# EAGLE schematic esquema_eletrico_eagle (EAGLE 9.7.0)
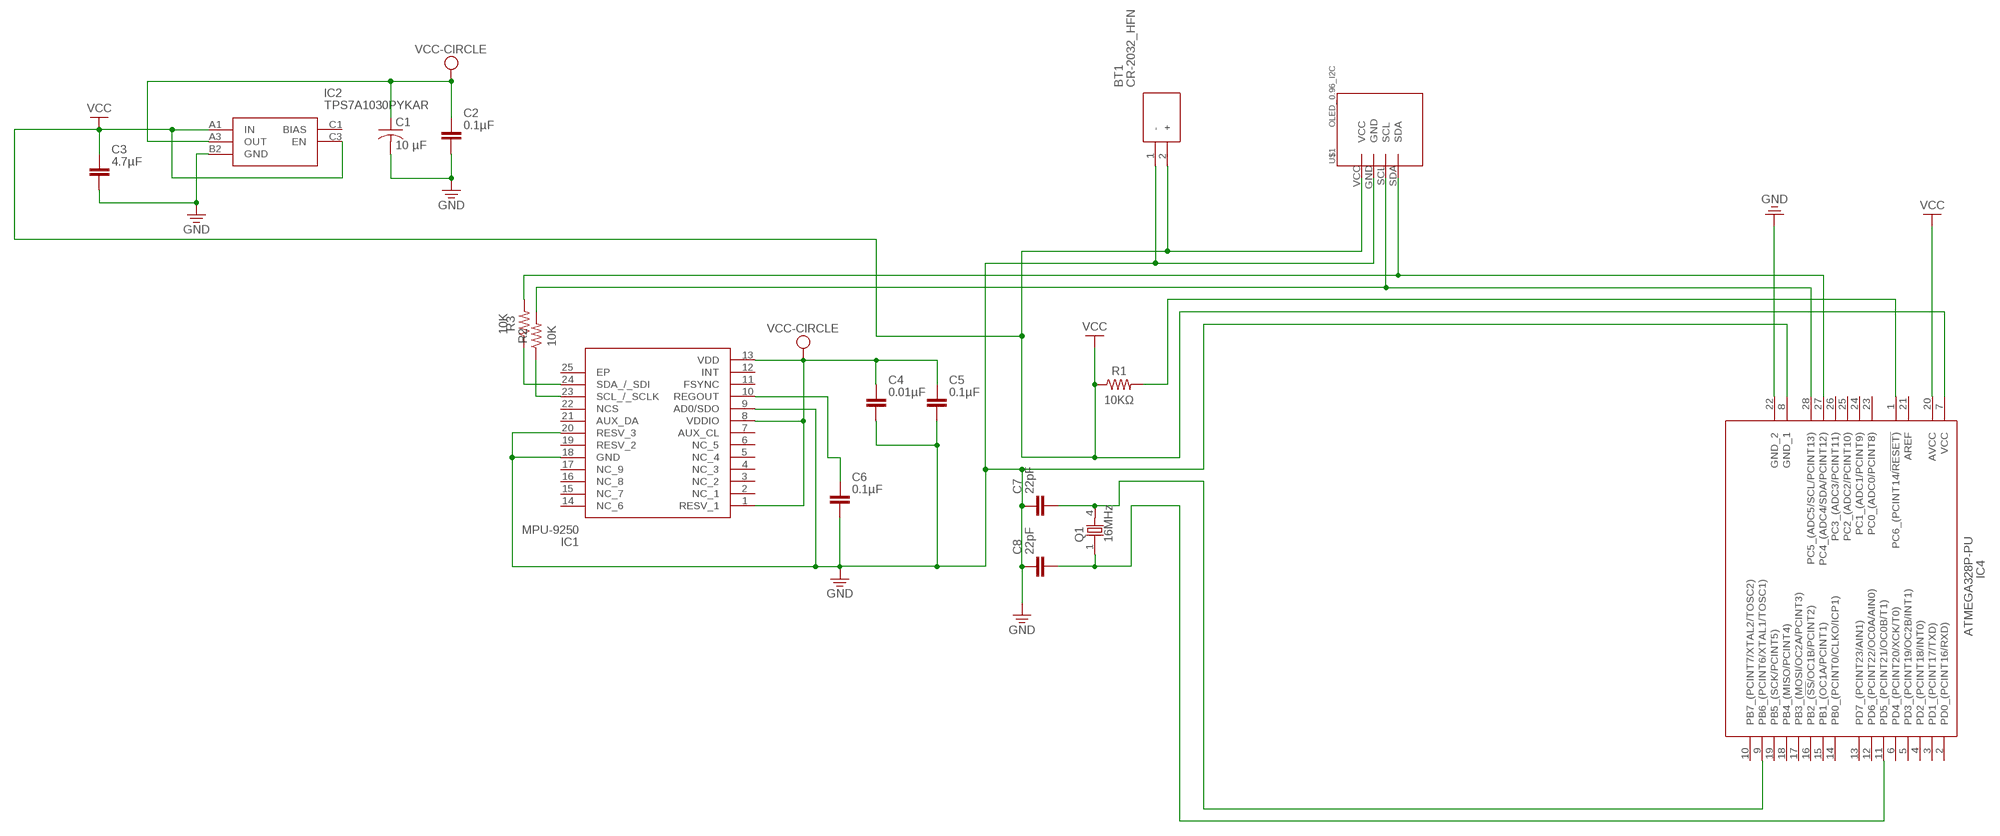
[diagram p0: schematic, sheet 1]

## Parts
BT1  CR-2032_HFN  [CR-2032HFN]
C1  10 µF  C-US_CHIP-0402(1005-METRIC)  [CAPC1005X60]
C2  0.1µF  C_CHIP-0402(1005-METRIC)  [CAPC1005X60]
C3  4.7µF  C_CHIP-0402(1005-METRIC)  [CAPC1005X60]
C4  0.01µF  C_CHIP-0402(1005-METRIC)  [CAPC1005X60]
C5  0.1µF  C_CHIP-0402(1005-METRIC)  [CAPC1005X60]
C6  0.1µF  C_CHIP-0402(1005-METRIC)  [CAPC1005X60]
C7  22pF  C_CHIP-0402(1005-METRIC)  [CAPC1005X60]
C8  22pF  C_CHIP-0402(1005-METRIC)  [CAPC1005X60]
IC1  MPU-9250  [QFN40P300X300X105-25N]
IC2  TPS7A1030PYKAR  [TPS7A1030PYKAR]
IC4  ATMEGA328P-PU  [DIP794W53P254L3467H457Q28N]
Q1  16MHz  86SMX  [86SMX]
R1  10KΩ  R-US_CHIP-0603(1608-METRIC)  [RESC1608X60]
R2  10K  R-US_AXIAL-7.2MM-PITCH  [RESAD724W46L381D178B]
R3  10K  R-US_AXIAL-7.2MM-PITCH  [RESAD724W46L381D178B]
U$1  OLED_0.96_I2C  [OLED_0.96_I2C]

## Nets
GND: BT1.1(-) C1.2 C2.2 C3.2 C4.2 C5.2 C6.2 C7.1 C8.1 IC1.9(AD0/SDO) IC1.18(GND) IC1.20(RESV_3) IC2.B2(GND) IC4.8(GND_1) IC4.22(GND_2) U$1.GND
N$2: IC4.27(PC4_(ADC4/SDA/PCINT12)) R3.2 U$1.SDA
N$3: IC4.28(PC5_(ADC5/SCL/PCINT13)) R2.2 U$1.SCL
N$6: IC1.23(SCL_/_SCLK) R2.1
N$7: IC1.24(SDA_/_SDI) R3.1
N$9: C6.1 IC1.10(REGOUT)
N$10: IC4.1(PC6_(PCINT14/!RESET)) R1.2
N$11: C7.2 IC4.9(PB6_(PCINT6/XTAL1/TOSC1)) Q1.4
N$12: C8.2 IC4.11(PD5_(PCINT21/OC0B/T1)) Q1.1
VCC: BT1.2(+) C1.1 C2.1 C3.1 C4.1 C5.1 IC1.1(RESV_1) IC1.8(VDDIO) IC1.13(VDD) IC2.A1(IN) IC2.A3(OUT) IC2.C3(EN) IC4.7(VCC) IC4.20(AVCC) R1.1 U$1.VCC ; supply symbol labelled VCC-CIRCLE
Unconnected: IC1.2(NC_1) IC1.3(NC_2) IC1.4(NC_3) IC1.5(NC_4) IC1.6(NC_5) IC1.7(AUX_CL) IC1.11(FSYNC) IC1.12(INT) IC1.14(NC_6) IC1.15(NC_7) IC1.16(NC_8) IC1.17(NC_9) IC1.19(RESV_2) IC1.21(AUX_DA) IC1.22(NCS) IC1.25(EP) IC2.C1(BIAS) IC4.2(PD0_(PCINT16/RXD)) IC4.3(PD1_(PCINT17/TXD)) IC4.4(PD2_(PCINT18/INT0)) IC4.5(PD3_(PCINT19/OC2B/INT1)) IC4.6(PD4_(PCINT20/XCK/T0)) IC4.10(PB7_(PCINT7/XTAL2/TOSC2)) IC4.12(PD6_(PCINT22/OC0A/AIN0)) IC4.13(PD7_(PCINT23/AIN1)) IC4.14(PB0_(PCINT0/CLKO/ICP1)) IC4.15(PB1_(OC1A/PCINT1)) IC4.16(PB2_(!SS!/OC1B/PCINT2)) IC4.17(PB3_(MOSI/OC2A/PCINT3)) IC4.18(PB4_(MISO/PCINT4)) IC4.19(PB5_(SCK/PCINT5)) IC4.21(AREF) IC4.23(PC0_(ADC0/PCINT8)) IC4.24(PC1_(ADC1/PCINT9)) IC4.25(PC2_(ADC2/PCINT10)) IC4.26(PC3_(ADC3/PCINT11))

## Library data of the parts
BT1 = CR-2032_HFN:CR-2032_HFN: CR2032/1HF Non rechargeable Li coin cell Panasonic CR2032 3V Lithium Manganese Dioxide Coin Button Battery Source: Datasheet <http://industrial.panasonic.com/cdbs/www-data/pdf2/AAA4000/AAA4000DE87.pdf>; ARROW_PART_NUMBER: CR-2032/HFN; ARROW_PRICE-STOCK: https://www.arrow.com/en/products/cr-2032hfn/panasonic; DESCRIPTION: CR2032/1HF Non rechargeable Li coin cell Panasonic CR2032 3V Lithium Manganese Dioxide Coin Button Battery; HEIGHT: mm; MANUFACTURER_NAME: Panasonic; MANUFACTURER_PART_NUMBER: CR-2032/HFN; MOUSER_PART_NUMBER: 658-CR-2032/HFN; MOUSER_PRICE-STOCK: https://www.mouser.co.uk/ProductDetail/Panasonic-Battery/CR-2032-HFN?qs=w3%252Bcv6FlocpXdsVF%252BYgeww%3D%3D
C1 = Capacitor:C-US: Capacitor - ANSI; CATEGORY: Capacitor
C2-C8 = Capacitor:C: Capacitor - Generic; CATEGORY: Capacitor
IC1 = MPU-9250:MPU-9250: Accelerometer, Gyroscope, Magnetometer, 3 Axis Sensor IC, SPI Output Source: Datasheet <http://www.invensense.com/wp-content/uploads/2015/02/PS-MPU-9250A-01-v1.1.pdf>; ARROW_PART_NUMBER: MPU-9250; ARROW_PRICE-STOCK: https://www.arrow.com/en/products/mpu-9250/tdk; DESCRIPTION: Accelerometer, Gyroscope, Magnetometer, 3 Axis Sensor IC, SPI Output; HEIGHT: 1.05mm; MANUFACTURER_NAME: TDK; MANUFACTURER_PART_NUMBER: MPU-9250; MOUSER_PART_NUMBER: 410-MPU-9250; MOUSER_PRICE-STOCK: https://www.mouser.co.uk/ProductDetail/TDK-InvenSense/MPU-9250?qs=u4fy%2FsgLU9OhGjFkQSZssA%3D%3D
IC2 = LDO 3.3v:TPS7A1030PYKAR: 300-mA low-IQ ultra-low-dropout (LDO) (70 mV at 300 mA) linear regulator Source: Datasheet <http://www.ti.com/lit/gpn/tps7a10>; ARROW_PART_NUMBER: TPS7A1030PYKAR; ARROW_PRICE-STOCK: https://www.arrow.com/en/products/tps7a1030pykar/texas-instruments?region=nac; DESCRIPTION: 300-mA low-IQ ultra-low-dropout (LDO) (70 mV at 300 mA) linear regulator; HEIGHT: mm; MANUFACTURER_NAME: Texas Instruments; MANUFACTURER_PART_NUMBER: TPS7A1030PYKAR; MOUSER_PART_NUMBER: 595-TPS7A1030PYKAR; MOUSER_PRICE-STOCK: https://www.mouser.co.uk/ProductDetail/Texas-Instruments/TPS7A1030PYKAR?qs=gTYE2QTfZfS%252BOiFUcXGdIg%3D%3D
IC4 = ATMEGA328P-PU:ATMEGA328P-PU: MICROCHIP - ATMEGA328P-PU. - MICROCONTROLLER MCU, 8 BIT, ATMEGA, 20MHZ, DIP-28 Source: Datasheet <http://ww1.microchip.com/downloads/en/DeviceDoc/Atmel-42735-8-bit-AVR-Microcontroller-ATmega328-328P_Datasheet.pdf>; ARROW_PART_NUMBER: ATMEGA328P-PU; ARROW_PRICE-STOCK: https://www.arrow.com/en/products/atmega328p-pu/microchip-technology?region=nac; DESCRIPTION: MICROCHIP - ATMEGA328P-PU. - MICROCONTROLLER MCU, 8 BIT, ATMEGA, 20MHZ, DIP-28; HEIGHT: 4.572mm; MANUFACTURER_NAME: Microchip; MANUFACTURER_PART_NUMBER: ATMEGA328P-PU; MOUSER_PART_NUMBER: 556-ATMEGA328P-PU; MOUSER_PRICE-STOCK: https://www.mouser.co.uk/ProductDetail/Microchip-Technology-Atmel/ATMEGA328P-PU?qs=K8BHR703ZXguOQv3sKbWcg%3D%3D
Q1 = crystal:86SMX: CRYSTAL
R1-R3 = Resistor:R-US: Resistor Fixed - ANSI; CATEGORY: Resistor; SUB-CATEGORY: Fixed
U$1 = oled_autodesk:OLED_0.96_I2C